# Altium schematic sheet Glucometer-I.C.- Mis 2.SchDoc
size Letter
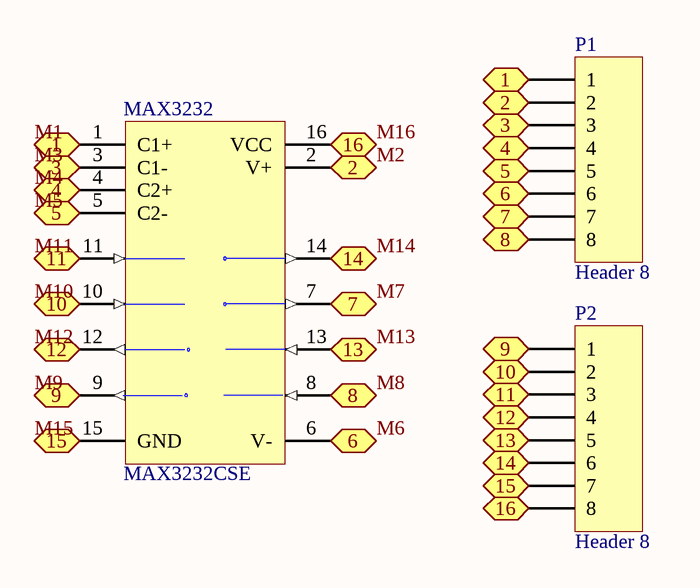
[diagram p0: Glucometer-I.C.- Mis 2.SchDoc]

## Parts
MAX3232  MAX3232CSE  [NSO16_N]
P1  Header 8  [HDR1X8]
P2  Header 8  [HDR1X8]

## Ports
1, 2, 3, 4, 5, 6, 7, 8, 9, 10, 11, 12, 13, 14, 15, 16

## Nets
M1: MAX3232.1(C1+) P1.1 ; port 1
M2: MAX3232.2(V+) P1.2 ; port 2
M3: MAX3232.3(C1-) P1.3 ; port 3
M4: MAX3232.4(C2+) P1.4 ; port 4
M5: MAX3232.5(C2-) P1.5 ; port 5
M6: MAX3232.6(V-) P1.6 ; port 6
M7: MAX3232.7(T2OUT) P1.7 ; port 7
M8: MAX3232.8(R2IN) P1.8 ; port 8
M9: MAX3232.9(R2OUT) P2.1 ; port 9
M10: MAX3232.10(T2IN) P2.2 ; port 10
M11: MAX3232.11(T1IN) P2.3 ; port 11
M12: MAX3232.12(R1OUT) P2.4 ; port 12
M13: MAX3232.13(R1IN) P2.5 ; port 13
M14: MAX3232.14(T1OUT) P2.6 ; port 14
M15: MAX3232.15(GND) P2.7 ; port 15
M16: MAX3232.16(VCC) P2.8 ; port 16

## Library data of the parts
MAX3232 = MAX3232CSE: 3.0V TO 5.5V, Low-Power, up to 1Mbps, True RS-232 Transceiver Using Four 0.1µF External Capacitor; Published: 16-Jan-2001; LatestRevisionDate: 13-Apr-2006; LatestRevisionNote: IPC-7351 Footprint Added.; DatasheetVersion: Mar-1999; PackageReference: NSO16; Publisher: Altium Limited; PackageDescription: 16-Pin Small Outline Integrated Circuit 1.27 mm Pitch; Code_JEDEC: MS-012-AC; Code_IPC: SOIC127P600-16; ComponentLink1Description: Manufacturer Link; ComponentLink1URL: http://www.maxim-ic.com/; ComponentLink2Description: Datasheet; ComponentLink2URL: http://pdfserv.maxim-ic.com/en/ds/MAX3222-MAX3241.pdf
P1 P2 = Header 8: Header, 8-Pin; LatestRevisionDate: 17-Jul-2002; LatestRevisionNote: Re-released for DXP Platform.; Publisher: Altium Limited